# EAGLE design AS3364 quad VCA 0402 DIL-non inv v1.0 (EAGLE 9.6.2)
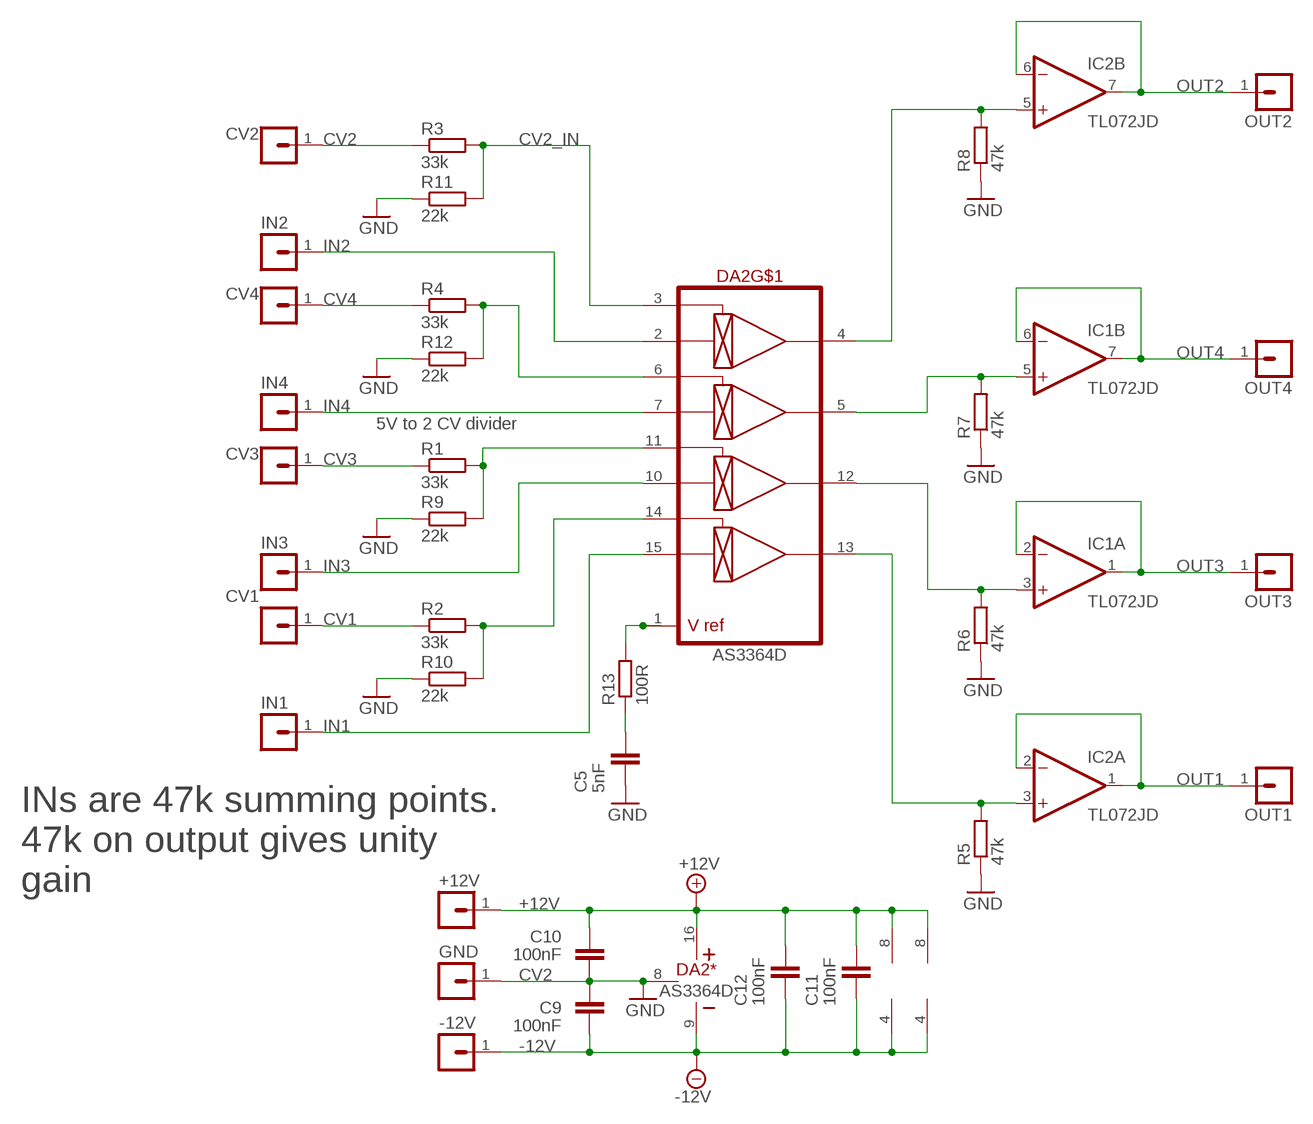
[diagram p0: schematic, sheet 1]

## Parts
+12V  MA01-1JP  [SIP-PIN01-1J]
-12V  MA01-1JP  [SIP-PIN01-1J]
C5  5nF  C-EUC0402  [C0402]
C9  100nF  C-EUC0402  [C0402]
C10  100nF  C-EUC0402  [C0402]
C11  100nF  C-EUC0402  [C0402]
C12  100nF  C-EUC0402  [C0402]
CV1  MA01-1JP  [SIP-PIN01-1J]
CV2  MA01-1JP  [SIP-PIN01-1J]
CV3  MA01-1JP  [SIP-PIN01-1J]
CV4  MA01-1JP  [SIP-PIN01-1J]
DA2  AS3364D  [DIL16J]
GND  MA01-1JP  [SIP-PIN01-1J]
IC1  TL072JD  [SO08J]
IC2  TL072JD  [SO08J]
IN1  MA01-1JP  [SIP-PIN01-1J]
IN2  MA01-1JP  [SIP-PIN01-1J]
IN3  MA01-1JP  [SIP-PIN01-1J]
IN4  MA01-1JP  [SIP-PIN01-1J]
OUT1  MA01-1JP  [SIP-PIN01-1J]
OUT2  MA01-1JP  [SIP-PIN01-1J]
OUT3  MA01-1JP  [SIP-PIN01-1J]
OUT4  MA01-1JP  [SIP-PIN01-1J]
R1  33k  R-EU_R0402  [R0402]
R2  33k  R-EU_R0402  [R0402]
R3  33k  R-EU_R0402  [R0402]
R4  33k  R-EU_R0402  [R0402]
R5  47k  R-EU_R0402  [R0402]
R6  47k  R-EU_R0402  [R0402]
R7  47k  R-EU_R0402  [R0402]
R8  47k  R-EU_R0402  [R0402]
R9  22k  R-EU_R0402  [R0402]
R10  22k  R-EU_R0402  [R0402]
R11  22k  R-EU_R0402  [R0402]
R12  22k  R-EU_R0402  [R0402]
R13  100R  R-EU_R0402  [R0402]

## Nets
+12V: +12V.1 C10.2 C11.2 C12.2 DA2.16(*:V+) IC1.8(P:V+) IC2.8(P:V+)
-12V: -12V.1 C9.1 C11.1 C12.1 DA2.9(*:V-) IC1.4(P:V-) IC2.4(P:V-)
CV1: CV1.1 R2.1
CV2: CV2.1 R3.1
CV2_IN: DA2.3(CV1) R3.2 R11.2
CV3: CV3.1 R1.1
CV4: CV4.1 R4.1
GND: C5.1 C9.2 C10.1 DA2.8(*:GND) GND.1 R5.1 R6.1 R7.1 R8.1 R9.1 R10.1 R11.1 R12.1
IN1: DA2.15(IN4) IN1.1
IN2: DA2.2(IN1) IN2.1
IN3: DA2.10(IN3) IN3.1
IN4: DA2.7(IN2) IN4.1
N$2: DA2.1(VREF) R13.2
N$4: DA2.4(OUT1) IC2.5(B:+IN) R8.2
N$6: DA2.5(OUT2) IC1.5(B:+IN) R7.2
N$10: DA2.6(CV2) R4.2 R12.2
N$11: DA2.12(OUT3) IC1.3(A:+IN) R6.2
N$12: DA2.11(CV3) R1.2 R9.2
N$13: DA2.13(OUT4) IC2.3(A:+IN) R5.2
N$14: C5.2 R13.1
N$21: DA2.14(CV4) R2.2 R10.2
OUT1: IC2.1(A:OUT) IC2.2(A:-IN) OUT1.1
OUT2: IC2.6(B:-IN) IC2.7(B:OUT) OUT2.1
OUT3: IC1.1(A:OUT) IC1.2(A:-IN) OUT3.1
OUT4: IC1.6(B:-IN) IC1.7(B:OUT) OUT4.1

## Notes on the sheet
- 5V to 2 CV divider
- INs are 47k summing points.
  47k on output gives unity
  gain

## Library data of the parts
+12V -12V CV1-CV4 GND IN1-IN4 OUT1-OUT4 = joakim:MA01-1J: PIN HEADER
C5 C9-C12 = rcl:C-EU: CAPACITOR, European symbol; SPICEPREFIX: C
DA2 = joakim:AS3364: AS3364 quad linear VCA, CEM3360 style. CV is 0 to 2V Vcc-Vee = 26V max, so +/-12V or +15V/-9V
IC1 IC2 = joakim:TL072J: OP AMP
R1-R13 = rcl:R-EU_: RESISTOR, European symbol; SPICEPREFIX: R

## Board
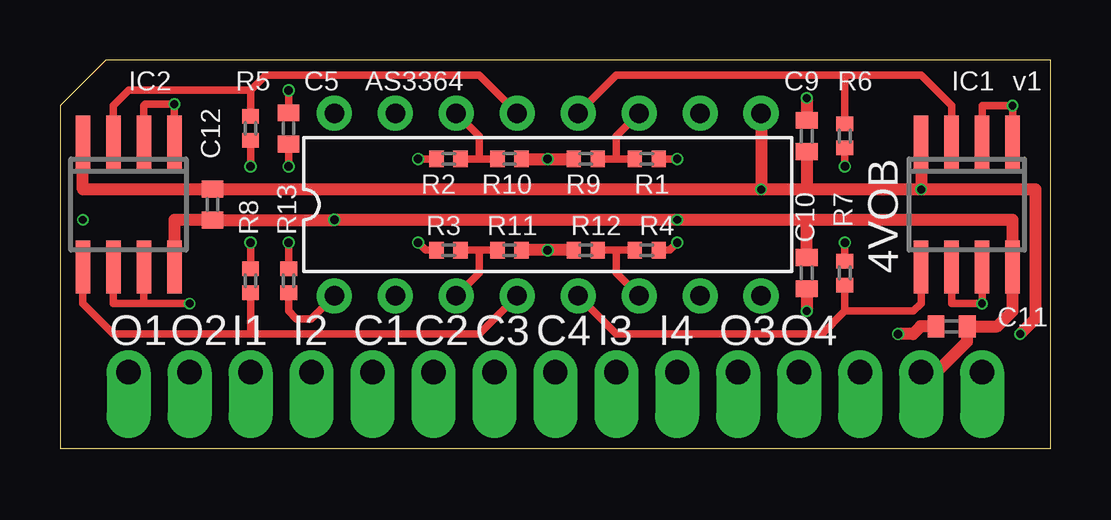
[diagram p1: board, top side]
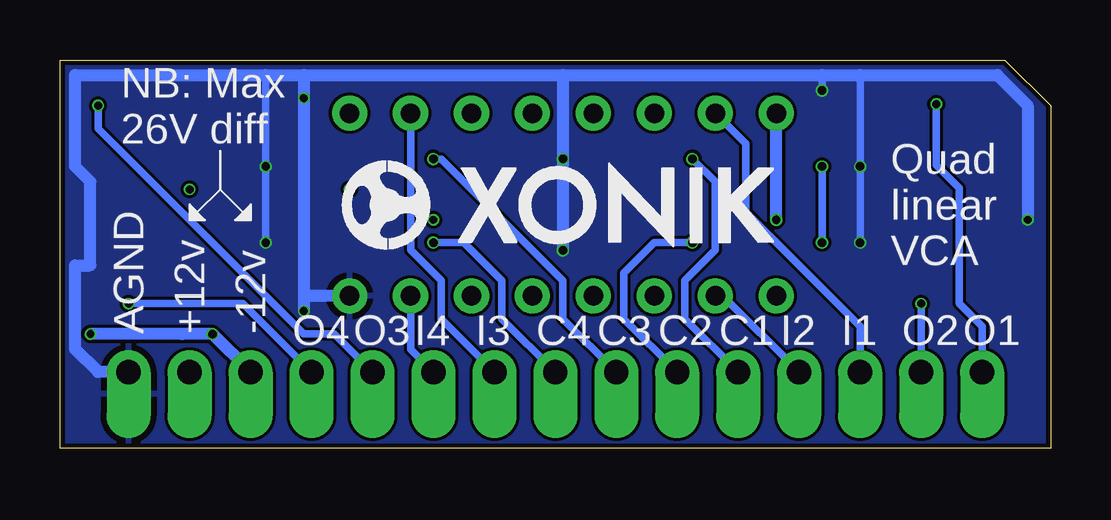
[diagram p2: board, bottom side, seen from below]

Size 41.27 x 16.19 mm. Coordinates in mm from the lower left corner, seen from the top.
Outline: 0,0 41.27,0 41.27,16.19 1.91,16.19 0,14.29 0,0
Copper layers (1*16): Top 0.035mm / dielectric 1.6mm / Bottom 0.035mm
Design rules "jlcpcb-2layers": minimum track width 5mil, minimum drill 0.3mm, track to track 5mil, track to pad 5mil, pad to pad 5mil, via to via 5mil, smd to smd 5mil, copper to edge 0.2mm, drill to drill 6mil, minimum pad ring 10mil, minimum via ring 3mil, stop-mask expansion 4mil, vias tented up to drill 0mil, thermal gap 10mil

### Footprints (pad centres in the part's own frame; a part is rotated, then mirrored left to right if it is on the bottom)
SIP-PIN01-1J = drill 1.016 offset: 1 0,0
C0402 = smd 0.7 x 0.9: 1 -0.65,0; 2 0.65,0
DIL16J = drill 0.813: 1 -8.89,-3.81; 2 -6.35,-3.81; 3 -3.81,-3.81; 4 -1.27,-3.81; 5 1.27,-3.81; 6 3.81,-3.81; 7 6.35,-3.81; 8 8.89,-3.81; 9 8.89,3.81; 10 6.35,3.81; 11 3.81,3.81; 12 1.27,3.81; 13 -1.27,3.81; 14 -3.81,3.81; 15 -6.35,3.81; 16 -8.89,3.81
SO08J = smd 0.6 x 2.2: 1 -1.905,-2.6; 2 -0.635,-2.6; 3 0.635,-2.6; 4 1.905,-2.6; 5 1.905,2.6; 6 0.635,2.6; 7 -0.635,2.6; 8 -1.905,2.6
R0402 = smd 0.6 x 0.7: 1 -0.5,0; 2 0.5,0

### Placement (x,y rotation side)
+12V  35.88,3.17 0 top
-12V  33.34,3.17 0 top
C5  9.53,13.34 270 top
C9  31.11,13.02 90 top
C10  31.11,7.3 90 top
C11  37.15,5.08 0 top
C12  6.35,10.16 270 top
CV1  13.02,3.17 0 top
CV2  15.56,3.17 0 top
CV3  18.1,3.17 0 top
CV4  20.64,3.17 0 top
DA2  20.32,10.16 0 top
GND  38.42,3.17 0 top
IC1  37.78,10.16 180 top
IC2  2.86,10.16 180 top
IN1  7.94,3.17 0 top
IN2  10.48,3.17 0 top
IN3  23.18,3.17 0 top
IN4  25.72,3.17 0 top
OUT1  2.86,3.17 0 top
OUT2  5.4,3.17 0 top
OUT3  28.26,3.17 0 top
OUT4  30.8,3.17 0 top
R1  24.45,12.06 180 top
R2  16.19,12.06 0 top
R3  16.19,8.26 0 top
R4  24.45,8.26 180 top
R5  7.94,13.34 90 top
R6  32.7,13.02 90 top
R7  32.7,7.3 270 top
R8  7.94,6.99 270 top
R9  21.91,12.06 0 top
R10  18.73,12.06 180 top
R11  18.73,8.26 180 top
R12  21.91,8.26 0 top
R13  9.53,6.99 270 top
U$1  [XONIK_LOGO_18]  29.53,8.31 0 bottom

### Tracks (layer width: path | path; a pad name or v marks a point on that pad's centre or on a via)
+12V  (via drill 0.33, 0.35)
  Top 0.508: IC2.8 4.76,9.53 6.35,9.53 | 31.11,9.53 39.69,9.53 IC1.8 39.69,5.71 39.05,5.08 C11.2 37.8,4.45 36.51,3.16 35.89,3.16 +12V.1 | 31.11,9.53 v25.72,9.53 v11.43,9.53 6.35,9.53 | C12.2 6.35,9.53 | C10.2 31.11,9.53
  Bottom 0.508: v11.43,9.53 DA2.16
-12V  (via drill 0.33, 0.35)
  Top 0.508: IC1.4 v35.88,10.79 | IC2.4 0.95,10.79 6.35,10.79 | v35.88,10.79 31.11,10.79 | 31.11,10.79 v29.21,10.79 | v29.21,10.79 6.35,10.79 | C12.1 6.35,10.79 | C9.1 31.11,10.79 | C11.1 35.86,5.08 35.55,4.76 v34.92,4.76 | v40.01,4.76 40.64,5.4 40.64,10.79 v35.88,10.79 | DA2.9 v29.21,10.79
  Bottom 0.508: v40.01,4.76 36.2,4.76 v34.92,4.76 -12V.1
CV1  (via drill 0.35)
  Top 0.305: R2.1 v14.92,12.06
  Bottom 0.305: v14.92,12.06 13.97,11.11 13.97,8.26 15.24,6.99 15.24,5.4 CV1.1
CV2  (via drill 0.35)
  Top 0.305: v14.92,8.57 15.24,8.26 R3.1
  Bottom 0.305: v14.92,8.57 16.51,8.57 17.78,7.3 17.78,5.4 CV2.1
CV2_IN
  Top 0.305: 17.46,8.26 17.46,7.3 DA2.3 | 17.46,8.26 R11.2 | R3.2 17.46,8.26
CV3  (via drill 0.35)
  Top 0.305: v25.72,12.06 R1.1
  Bottom 0.305: v25.72,12.06 25.4,12.06 20.32,6.99 20.32,5.4 CV3.1
CV4  (via drill 0.35)
  Top 0.305: R4.1 25.4,8.26 v25.72,8.57
  Bottom 0.305: v25.72,8.57 24.45,8.57 22.86,6.99 22.86,5.4 CV4.1
GND  (via drill 0.33, 0.35)
  Top 0.305: C5.1 v9.53,14.92 | R5.1 v7.94,11.75 | R8.1 v7.94,8.57 | R6.1 v32.7,11.75 | R7.1 v32.7,8.57
  Top 0.508: v31.11,14.61 C9.2 | C10.1 v31.11,5.71 | R11.1 v20.32,8.26 R12.1 | R10.1 v20.32,12.06 R9.1
  Bottom 0.305: v9.53,14.92 9.53,15.56 | 7.94,15.56 v7.94,11.75 v7.94,8.57 | 32.7,15.56 v32.7,11.75 v32.7,8.57
  Bottom 0.508: 31.11,15.56 32.7,15.56 40.64,15.56 40.64,11.75 40.01,11.11 40.01,7.62 40.64,7.62 40.64,4.13 39.69,3.17 GND.1 | 31.11,15.56 20.32,15.56 | 20.32,15.56 9.53,15.56 7.94,15.56 2.22,15.56 0.95,14.29 v0.95,9.53 | 31.11,15.56 v31.11,14.61 31.11,6.35 | 31.11,6.35 v31.11,5.71 | 20.32,15.56 v20.32,12.06 v20.32,8.26 | DA2.8 31.11,6.35
  pour Bottom: 0,0 0,16.19 41.27,16.19 41.27,0
IN1
  Bottom 0.305: IN1.1 7.94,5.08 12.7,9.84 12.7,12.7 DA2.15
IN2
  Bottom 0.305: DA2.2 13.65,6.35 IN2.1
IN3
  Bottom 0.305: DA2.10 26.67,8.26 25.4,6.99 25.4,5.4 IN3.1
IN4
  Bottom 0.305: DA2.7 26.67,4.13 IN4.1
N$2
  Top 0.305: DA2.1 10.48,5.4 9.84,5.4 9.53,5.71 R13.2
N$4
  Top 0.305: DA2.4 17.46,4.76 7.94,4.76 | 7.94,4.76 2.22,4.76 0.95,6.03 IC2.5 | R8.2 7.94,4.76
N$6
  Top 0.305: DA2.5 23.18,4.76 31.75,4.76 32.7,5.71 | IC1.5 35.88,6.03 35.56,5.71 32.7,5.71 | R7.2 32.7,5.71
N$10
  Top 0.305: R12.2 R4.2 23.18,8.26 23.18,7.3 DA2.6
N$11
  Top 0.305: 32.7,15.56 35.88,15.56 37.15,14.29 IC1.3 | 32.7,15.56 23.18,15.56 DA2.12 | R6.2 32.7,15.56
N$12
  Top 0.305: 23.18,12.06 23.18,13.02 DA2.11 | R1.2 23.18,12.06 | 23.18,12.06 R9.2
N$13
  Top 0.305: DA2.13 17.46,15.56 8.57,15.56 7.94,14.92 | IC2.3 2.22,14.29 2.86,14.92 7.94,14.92 | R5.2 7.94,14.92
N$14  (via drill 0.35)
  Top 0.305: R13.1 v9.53,8.57 | C5.2 v9.53,11.75
  Bottom 0.305: v9.53,11.75 v9.53,8.57
N$21
  Top 0.305: 17.46,12.06 17.46,13.02 DA2.14 | R2.2 17.46,12.06 | 17.46,12.06 R10.2
OUT1  (via drill 0.33)
  Top 0.305: IC2.1 v4.76,14.35 3.55,14.35 3.49,14.29 IC2.2
  Bottom 0.305: v4.76,14.35 4.76,11.81 3.81,10.86 3.81,6.03 2.86,5.08 OUT1.1
OUT2  (via drill 0.33)
  Top 0.305: IC2.7 3.49,6.03 | 3.49,6.03 v5.4,6.03 | IC2.6 2.22,6.03 3.49,6.03
  Bottom 0.305: v5.4,6.03 OUT2.1
OUT3  (via drill 0.33)
  Top 0.305: IC1.1 v39.69,14.29 38.42,14.29 IC1.2
  Bottom 0.305: v39.69,14.29 39.69,13.34 31.11,4.76 29.84,4.76 OUT3.1
OUT4  (via drill 0.33)
  Top 0.305: IC1.7 v38.42,6.03 37.15,6.03 IC1.6
  Bottom 0.305: v38.42,6.03 33.66,6.03 OUT4.1

### Text on the board
tNames: AS3364 | v1 | 4VOB | O1 | O2 | I1 | I2 | C1 | C2 | C3 | C4 | I3 | I4 | O3 | O4
bNames: NB: Max / 26V diff | Quad / linear / VCA | -12v | +12v | AGND | O1 | O2 | I1 | I2 | C1 | C2 | C3 | C4 | I3 | I4 | O3 | O4